# EAGLE board A500R8 (EAGLE 7.6.0), part 1 of 5
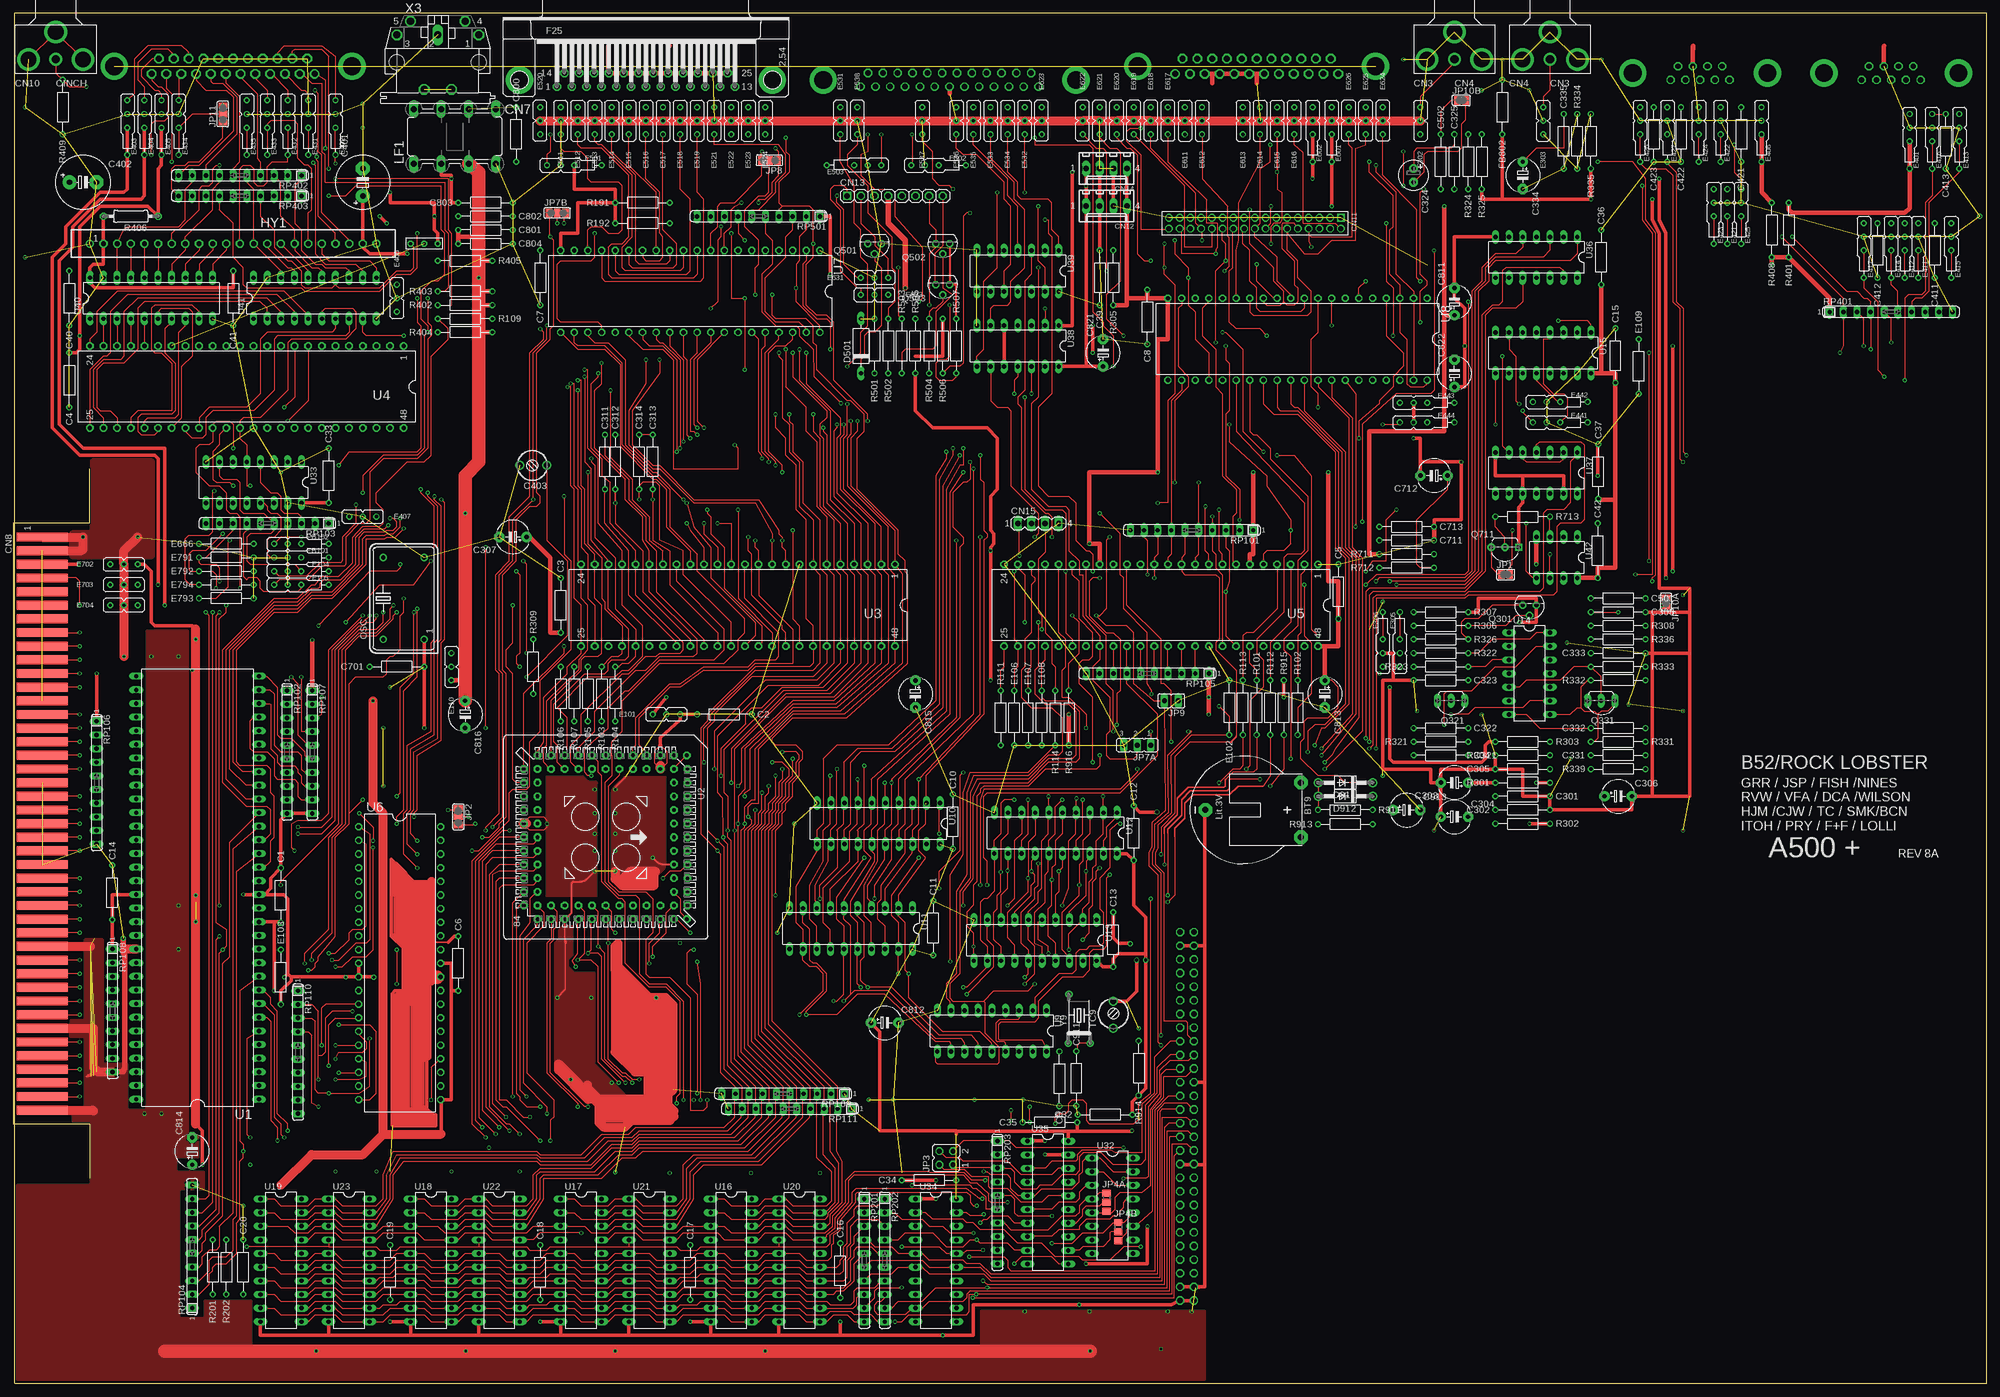
[diagram p9: board, top side]
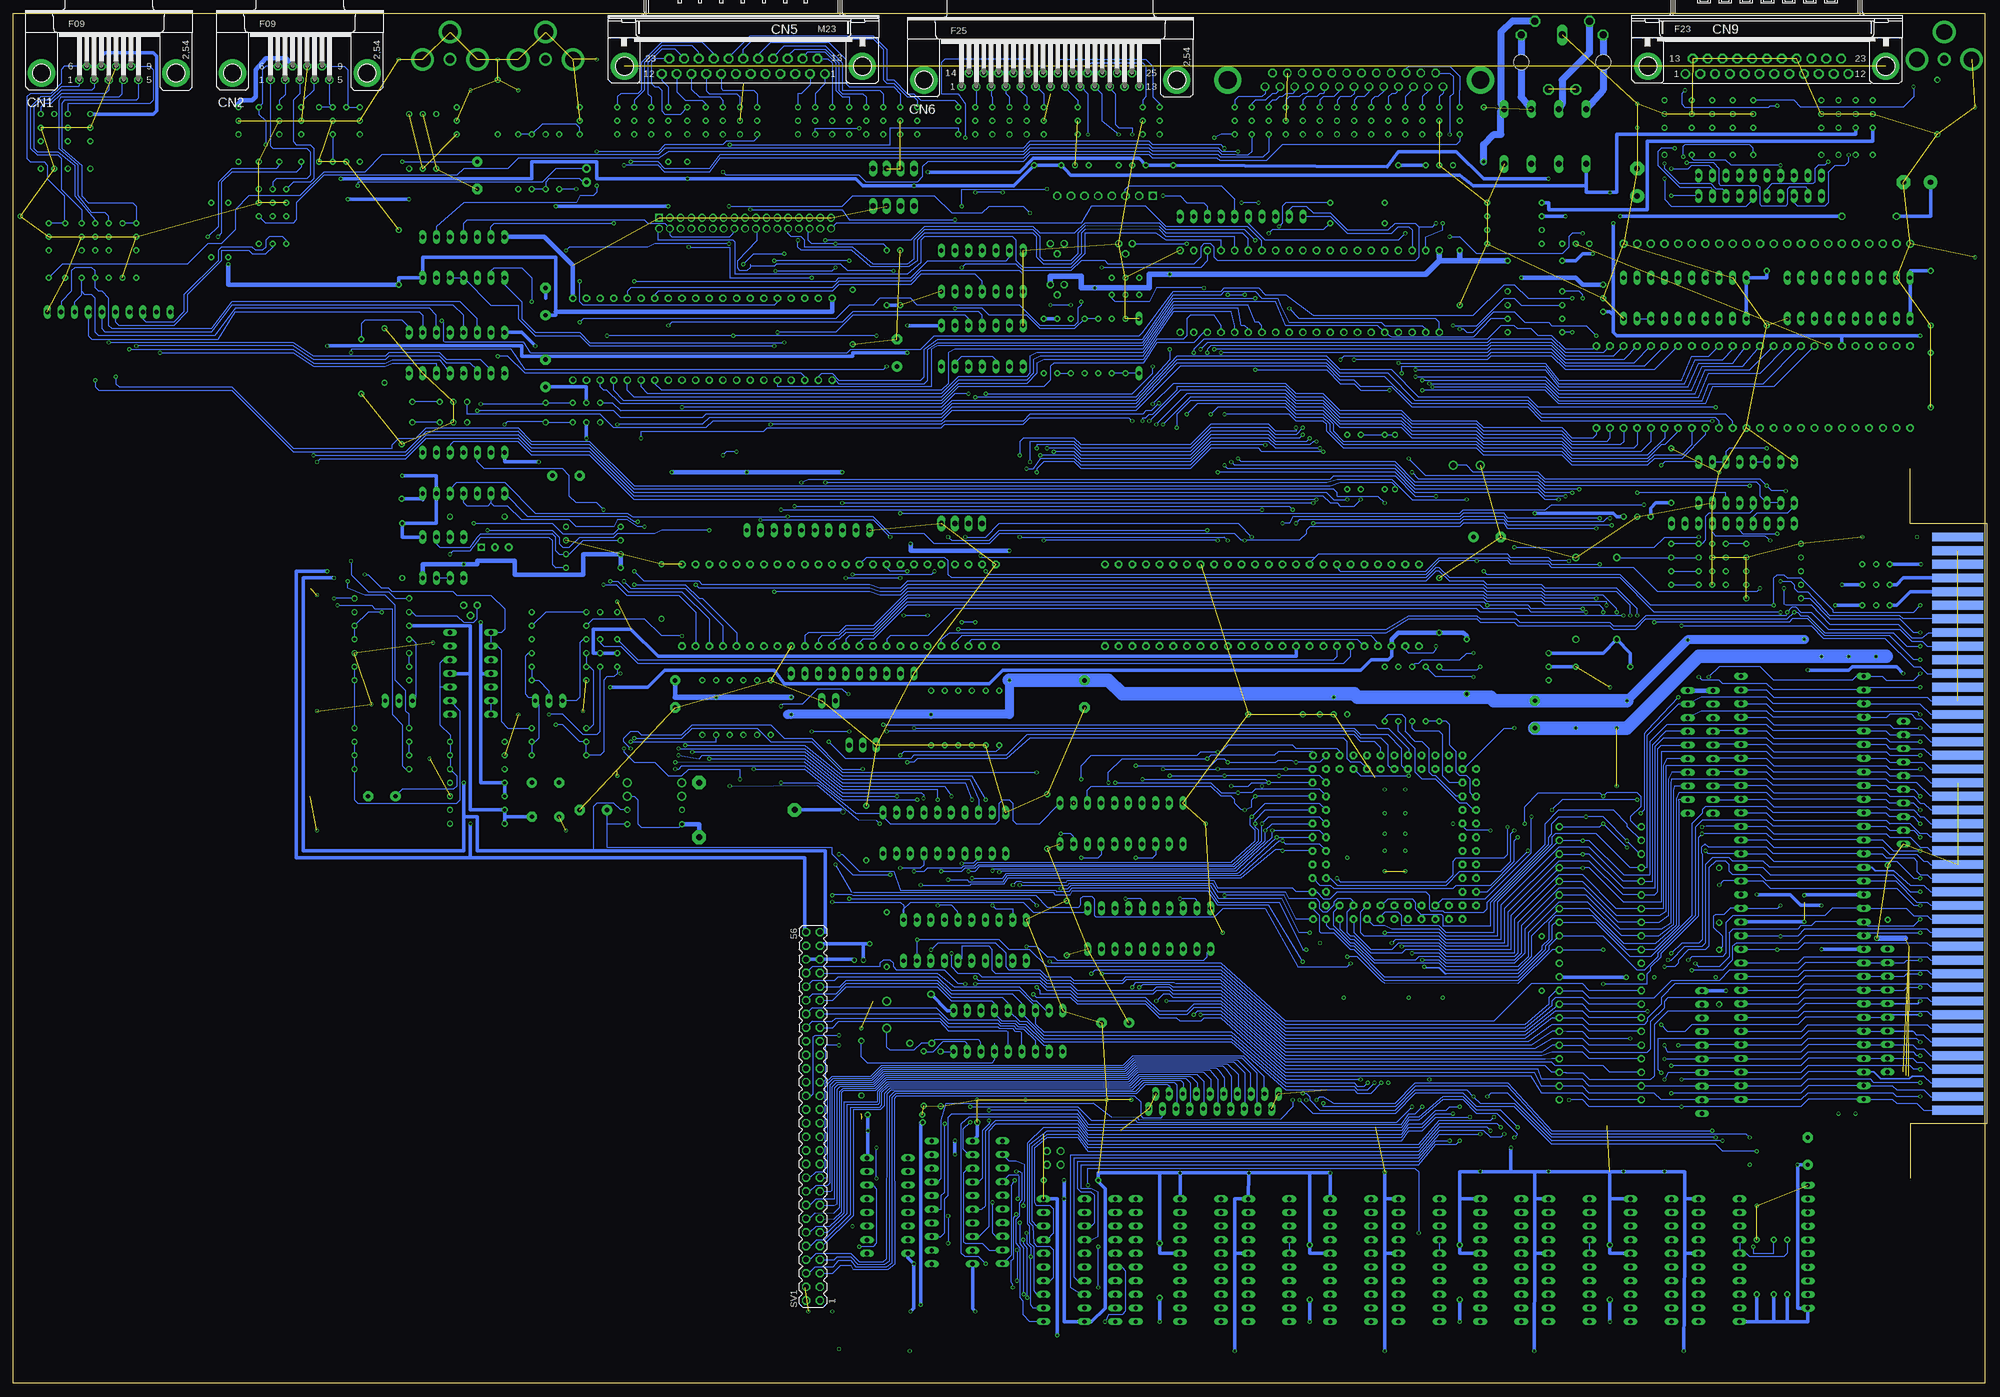
[diagram p10: board, bottom side, seen from below]

Size 367.26 x 254.94 mm. Coordinates in mm from the lower left corner, seen from the top.
Outline: 0.25,0 367.26,0 367.26,254.94 0.25,254.94
Outline: 0.23,0 0.23,254.94
Copper layers (1*16): Top 0.035mm / dielectric 1.5mm / Bottom 0.035mm
Design rules "dirt_cheap_dirty_boards.v1": minimum track width 5mil, minimum drill 12mil, track to track 5mil, track to pad 5mil, pad to pad 5mil, via to via 5mil, smd to smd 0mil, copper to edge 10mil, drill to drill 10mil, minimum pad ring 10mil, minimum via ring 6mil, stop-mask expansion 2mil, vias tented up to drill 25mil, thermal gap 10mil

## Footprints (pad centres in the part's own frame; a part is rotated, then mirrored left to right if it is on the bottom)
CR2032H = drill 1.118 pad 2.54 octagon: + 5.08,10.795; +@1 -5.08,10.795; - 0,-6.985
C10B4 = drill 0.6: 1 -5.08,0; 2 5.08,0
E5-6 = drill 0.813 pad 1.905: + -2.54,0 | drill 0.813 pad 1.905 octagon: - 2.54,0
R10B4 = drill 0.6: 1 -5.08,0; 2 5.08,0
E2,5-6 = drill 0.813 pad 1.6: + -1.27,0 | drill 0.813 pad 1.6 octagon: - 1.27,0
E5-10,5 = drill 1.016 pad 2.54: + -2.54,0 | drill 1.016 pad 2.54 octagon: - 2.54,0
CTRIM3050.504 = drill 1.1: 1 -2.5,0; 2 2.5,0
F09HP = drill 1.016 octagon: 1 -5.486,-1.27; 2 -2.743,-1.27; 3 0,-1.27; 4 2.743,-1.27; 5 5.486,-1.27; 6 -4.115,1.27; 7 -1.372,1.27; 8 1.372,1.27; 9 4.115,1.27 | drill 3.302 pad 5.08: G1 -12.522,0; G2 12.522,0
CINCH-B = drill 2.9 pad 4.2: P$2 -5.08,0; P$3 5.08,0; P$4 0,5.08 | drill 1.5 pad 2.4: S 0,0
M23H_FC = drill 1.1 pad 1.8: 1 -15.172,1.429 | drill 1.1 pad 1.8 octagon: 2 -12.403,1.429; 3 -9.66,1.429; 4 -6.891,1.429; 5 -4.123,1.429; 6 -1.379,1.429; 7 1.389,1.429; 8 4.158,1.429; 9 6.901,1.429; 10 9.669,1.429; 11 12.438,1.429; 12 15.181,1.429; 13 -13.8,-1.429; 14 -11.031,-1.429; 15 -8.263,-1.429; 16 -5.52,-1.429; 17 -2.751,-1.429; 18 0.018,-1.429; 19 2.761,-1.429; 20 5.529,-1.429; 21 8.298,-1.429; 22 11.041,-1.429; 23 13.81,-1.429 | drill 3.302 pad 5.08: G1 -22.131,0; G2 22.131,0
F25HP = drill 1.016 octagon: 1 -16.561,-1.27; 2 -13.792,-1.27; 3 -11.049,-1.27; 4 -8.28,-1.27; 5 -5.512,-1.27; 6 -2.769,-1.27; 7 0,-1.27; 8 2.769,-1.27; 9 5.512,-1.27; 10 8.28,-1.27; 11 11.049,-1.27; 12 13.792,-1.27; 13 16.561,-1.27; 14 -15.189,1.27; 15 -12.421,1.27; 16 -9.652,1.27; 17 -6.909,1.27; 18 -4.14,1.27; 19 -1.372,1.27; 20 1.372,1.27; 21 4.14,1.27; 22 6.909,1.27; 23 9.652,1.27; 24 12.421,1.27; 25 15.189,1.27 | drill 3.302 pad 5.08: G1 -23.52,0; G2 23.52,0
LKONT_43 = smd 1.65 x 9.5: 1 -53.34,0; 3 -50.8,0; 5 -48.26,0; 7 -45.72,0; 9 -43.18,0; 11 -40.64,0; 13 -38.1,0; 15 -35.56,0; 17 -33.02,0; 19 -30.48,0; 21 -27.94,0; 23 -25.4,0; 25 -22.86,0; 27 -20.32,0; 29 -17.78,0; 31 -15.24,0; 33 -12.7,0; 35 -10.16,0; 37 -7.62,0; 39 -5.08,0; 41 -2.54,0; 43 0,0; 45 2.54,0; 47 5.08,0; 49 7.62,0; 51 10.16,0; 53 12.7,0; 55 15.24,0; 57 17.78,0; 59 20.32,0; 61 22.86,0; 63 25.4,0; 65 27.94,0; 67 30.48,0; 69 33.02,0; 71 35.56,0; 73 38.1,0; 75 40.64,0; 77 43.18,0; 79 45.72,0; 81 48.26,0; 83 50.8,0; 85 53.34,0 | smd 1.65 x 9.5 bottom: 2 -53.34,0; 4 -50.8,0; 6 -48.26,0; 8 -45.72,0; 10 -43.18,0; 12 -40.64,0; 14 -38.1,0; 16 -35.56,0; 18 -33.02,0; 20 -30.48,0; 22 -27.94,0; 24 -25.4,0; 26 -22.86,0; 28 -20.32,0; 30 -17.78,0; 32 -15.24,0; 34 -12.7,0; 36 -10.16,0; 38 -7.62,0; 40 -5.08,0; 42 -2.54,0; 44 0,0; 46 2.54,0; 48 5.08,0; 50 7.62,0; 52 10.16,0; 54 12.7,0; 56 15.24,0; 58 17.78,0; 60 20.32,0; 62 22.86,0; 64 25.4,0; 66 27.94,0; 68 30.48,0; 70 33.02,0; 72 35.56,0; 74 38.1,0; 76 40.64,0; 78 43.18,0; 80 45.72,0; 82 48.26,0; 84 50.8,0; 86 53.34,0
F23H_FC = drill 1.1 pad 1.8: 1 -15.172,-1.429 | drill 1.1 pad 1.8 octagon: 2 -12.403,-1.429; 3 -9.66,-1.429; 4 -6.891,-1.429; 5 -4.123,-1.429; 6 -1.38,-1.429; 7 1.389,-1.429; 8 4.158,-1.429; 9 6.901,-1.429; 10 9.669,-1.429; 11 12.438,-1.429; 12 15.181,-1.429; 13 -13.8,1.429; 14 -11.032,1.429; 15 -8.263,1.429; 16 -5.52,1.429; 17 -2.751,1.429; 18 0.017,1.429; 19 2.761,1.429; 20 5.529,1.429; 21 8.298,1.429; 22 11.041,1.429; 23 13.81,1.429 | drill 3.302 pad 5.08: G1 -22.131,0; G2 22.131,0
2X17M = drill 0.914 square: 1 -14.73,-1 | drill 0.914: 2 -14.73,1; 3 -12.73,-1; 4 -12.73,1; 5 -10.73,-1; 6 -10.73,1; 7 -8.73,-1; 8 -8.73,1; 9 -6.73,-1; 10 -6.73,1; 11 -4.73,-1; 12 -4.73,1; 13 -2.73,-1; 14 -2.73,1; 15 -0.73,-1; 16 -0.73,1; 17 1.27,-1; 18 1.27,1; 19 3.27,-1; 20 3.27,1; 21 5.27,-1; 22 5.27,1; 23 7.27,-1; 24 7.27,1; 25 9.27,-1; 26 9.27,1; 27 11.27,-1; 28 11.27,1; 29 13.27,-1; 30 13.27,1; 31 15.27,-1; 32 15.27,1; 33 17.27,-1; 34 17.27,1
6410-04 = drill 1.016 long: 1 3.81,0; 2 1.27,0; 3 -1.27,0; 4 -3.81,0
1X08S = drill 1.016 square: 1 -7.62,0 | drill 1.016 octagon: 2 -5.08,0; 3 -2.54,0; 4 0,0; 5 2.54,0; 6 5.08,0; 7 7.62,0; 8 10.16,0
MA04-1 = drill 1.016 long: 1 -3.81,0; 2 -1.27,0; 3 1.27,0; 4 3.81,0
D-10 = drill 0.813 long: A 5.08,0; C -5.08,0
DO41-10 = drill 1.118: A 5.08,0; C -5.08,0
EMIFILTER = drill 0.6: 1 1.27,0; 2 6.35,0; 3 3.81,0
EMIFILTLONG = drill 0.6: 1 -3.81,0; 2 1.27,0; 3 6.35,0; 4 3.81,0
SIP22 = drill 0.9 pad 1.5: 1 -26.67,0 | drill 0.9 pad 1.5 octagon: 2 -24.13,0; 3 -21.59,0; 4 -19.05,0; 5 -16.51,0; 6 -13.97,0; 7 -11.43,0; 8 -8.89,0; 9 -6.35,0; 10 -3.81,0; 11 -1.27,0; 12 1.27,0; 13 3.81,0; 14 6.35,0; 15 8.89,0; 16 11.43,0; 17 13.97,0; 18 16.51,0; 19 19.05,0; 20 21.59,0; 21 24.13,0; 22 26.67,0
SJ = smd 1.168 x 1.6: 1 -0.762,0; 2 0.762,0
SJ_2 = smd 1.168 x 1.6: 1 -1.524,0; 2 0,0; 3 1.524,0
JP2Q = drill 0.914 octagon: 1 -1.27,-1.27; 2 -1.27,1.27; 3 1.27,-1.27; 4 1.27,1.27
A0R-JMP = smd 1.5 x 1.3: 1 0,1.7; 2 0,0; 3 0,-1.7
JP2 = drill 0.914 long: 1 -2.54,0; 2 0,0; 3 2.54,0
JP1 = drill 0.914 long: 1 0,-1.27; 2 0,1.27
DK31 = drill 1.118 long: 1 7.62,5.08; 2 2.54,5.08; 3 -2.54,5.08; 4 -7.62,5.08; 5 -7.62,-5.08; 6 -2.54,-5.08; 7 2.54,-5.08; 8 7.62,-5.08
AMIGACRYSTAL = drill 0.813: 1 -7.62,-3.81; 2 7.62,-3.81; 3 7.62,3.81; 4 -7.62,3.81
TO92D = drill 0.813 octagon: B 0,1.905; C 1.27,0; E -1.27,0
TO92- = drill 0.813 long: 1 2.54,0; 2 0,0; 3 -2.54,0
TO92 = drill 0.813 octagon: 1 1.27,0; 2 0,1.905; 3 -1.27,0
TRANSISTOR_TO92-ECB = drill 0.813 square: 1 -2.54,0 | drill 0.7 pad 1.422: 2 0,0; 3 2.54,0
0207/10 = drill 0.813 octagon: 1 -5.08,0; 2 5.08,0
SIL10 = drill 0.813 long: 1 -11.43,0; 2 -8.89,0; 3 -6.35,0; 4 -3.81,0; 5 -1.27,0; 6 1.27,0; 7 3.81,0; 8 6.35,0; 9 8.89,0; 10 11.43,0
AMIGA56 = drill 1.016 octagon: 1 -24.13,-1.27; 2 -24.13,1.27; 3 -21.59,-1.27; 4 -21.59,1.27; 5 -19.05,-1.27; 6 -19.05,1.27; 7 -16.51,-1.27; 8 -16.51,1.27; 9 -13.97,-1.27; 10 -13.97,1.27; 11 -11.43,-1.27; 12 -11.43,1.27; 13 -8.89,-1.27; 14 -8.89,1.27; 15 -6.35,-1.27; 16 -6.35,1.27; 17 -3.81,-1.27; 18 -3.81,1.27; 19 -1.27,-1.27; 20 -1.27,1.27; 21 1.27,-1.27; 22 1.27,1.27; 23 3.81,-1.27; 24 3.81,1.27; 25 6.35,-1.27; 26 6.35,1.27; 27 8.89,-1.27; 28 8.89,1.27; 29 11.43,-1.27; 30 11.43,1.27; 31 13.97,-1.27; 32 13.97,1.27; 33 16.51,-1.27; 34 16.51,1.27; 35 19.05,-1.27; 36 19.05,1.27; 37 21.59,-1.27; 38 21.59,1.27; 39 24.13,-1.27; 40 24.13,1.27; 41 26.67,-1.27; 42 26.67,1.27; 43 29.21,-1.27; 44 29.21,1.27; 45 31.75,-1.27; 46 31.75,1.27; 47 34.29,-1.27; 48 34.29,1.27; 49 36.83,-1.27; 50 36.83,1.27; 51 39.37,-1.27; 52 39.37,1.27; 53 41.91,-1.27; 54 41.91,1.27; 55 44.45,-1.27; 56 44.45,1.27
DIL64 = drill 0.813 long: 1 -39.37,-11.43; 2 -36.83,-11.43; 3 -34.29,-11.43; 4 -31.75,-11.43; 5 -29.21,-11.43; 6 -26.67,-11.43; 7 -24.13,-11.43; 8 -21.59,-11.43; 9 -19.05,-11.43; 10 -16.51,-11.43; 11 -13.97,-11.43; 12 -11.43,-11.43; 13 -8.89,-11.43; 14 -6.35,-11.43; 15 -3.81,-11.43; 16 -1.27,-11.43; 17 1.27,-11.43; 18 3.81,-11.43; 19 6.35,-11.43; 20 8.89,-11.43; 21 11.43,-11.43; 22 13.97,-11.43; 23 16.51,-11.43; 24 19.05,-11.43; 25 21.59,-11.43; 26 24.13,-11.43; 27 26.67,-11.43; 28 29.21,-11.43; 29 31.75,-11.43; 30 34.29,-11.43; 31 36.83,-11.43; 32 39.37,-11.43; 33 39.37,11.43; 34 36.83,11.43; 35 34.29,11.43; 36 31.75,11.43; 37 29.21,11.43; 38 26.67,11.43; 39 24.13,11.43; 40 21.59,11.43; 41 19.05,11.43; 42 16.51,11.43; 43 13.97,11.43; 44 11.43,11.43; 45 8.89,11.43; 46 6.35,11.43; 47 3.81,11.43; 48 1.27,11.43; 49 -1.27,11.43; 50 -3.81,11.43; 51 -6.35,11.43; 52 -8.89,11.43; 53 -11.43,11.43; 54 -13.97,11.43; 55 -16.51,11.43; 56 -19.05,11.43; 57 -21.59,11.43; 58 -24.13,11.43; 59 -26.67,11.43; 60 -29.21,11.43; 61 -31.75,11.43; 62 -34.29,11.43; 63 -36.83,11.43; 64 -39.37,11.43
PLCC84 = drill 0.7 pad 1.4: 1 0,15.24 | drill 0.7 pad 1.4 octagon: 2 0,12.7; 3 -2.54,15.24; 4 -2.54,12.7; 5 -5.08,15.24; 6 -5.08,12.7; 7 -7.62,15.24; 8 -7.62,12.7; 9 -10.16,15.24; 10 -10.16,12.7; 11 -12.7,15.24; 12 -15.24,12.7; 13 -12.7,12.7; 14 -15.24,10.16; 15 -12.7,10.16; 16 -15.24,7.62; 17 -12.7,7.62; 18 -15.24,5.08; 19 -12.7,5.08; 20 -15.24,2.54; 21 -12.7,2.54; 22 -15.24,0; 23 -12.7,0; 24 -15.24,-2.54; 25 -12.7,-2.54; 26 -15.24,-5.08; 27 -12.7,-5.08; 28 -15.24,-7.62; 29 -12.7,-7.62; 30 -15.24,-10.16; 31 -12.7,-10.16; 32 -15.24,-12.7; 33 -12.7,-15.24; 34 -12.7,-12.7; 35 -10.16,-15.24; 36 -10.16,-12.7; 37 -7.62,-15.24; 38 -7.62,-12.7; 39 -5.08,-15.24; 40 -5.08,-12.7; 41 -2.54,-15.24; 42 -2.54,-12.7; 43 0,-15.24; 44 0,-12.7; 45 2.54,-15.24; 46 2.54,-12.7; 47 5.08,-15.24; 48 5.08,-12.7; 49 7.62,-15.24; 50 7.62,-12.7; 51 10.16,-15.24; 52 10.16,-12.7; 53 12.7,-15.24; 54 15.24,-12.7; 55 12.7,-12.7; 56 15.24,-10.16; 57 12.7,-10.16; 58 15.24,-7.62; 59 12.7,-7.62; 60 15.24,-5.08; 61 12.7,-5.08; 62 15.24,-2.54; 63 12.7,-2.54; 64 15.24,0; 65 12.7,0; 66 15.24,2.54; 67 12.7,2.54; 68 15.24,5.08; 69 12.7,5.08; 70 15.24,7.62; 71 12.7,7.62; 72 15.24,10.16; 73 12.7,10.16; 74 15.24,12.7; 75 12.7,15.24; 76 12.7,12.7; 77 10.16,15.24; 78 10.16,12.7; 79 7.62,15.24; 80 7.62,12.7; 81 5.08,15.24; 82 5.08,12.7; 83 2.54,15.24; 84 2.54,12.7
DIP48-6 = drill 0.8 pad 1.4: 1 -27.94,-7.62 | drill 0.8 pad 1.4 octagon: 2 -25.4,-7.62; 3 -22.86,-7.62; 4 -20.32,-7.62; 5 -17.78,-7.62; 6 -15.24,-7.62; 7 -12.7,-7.62; 8 -10.16,-7.62; 9 -7.62,-7.62; 10 -5.08,-7.62; 11 -2.54,-7.62; 12 0,-7.62; 13 2.54,-7.62; 14 5.08,-7.62; 15 7.62,-7.62; 16 10.16,-7.62; 17 12.7,-7.62; 18 15.24,-7.62; 19 17.78,-7.62; 20 20.32,-7.62; 21 22.86,-7.62; 22 25.4,-7.62; 23 27.94,-7.62; 24 30.48,-7.62; 25 30.48,7.62; 26 27.94,7.62; 27 25.4,7.62; 28 22.86,7.62; 29 20.32,7.62; 30 17.78,7.62; 31 15.24,7.62; 32 12.7,7.62; 33 10.16,7.62; 34 7.62,7.62; 35 5.08,7.62; 36 2.54,7.62; 37 0,7.62; 38 -2.54,7.62; 39 -5.08,7.62; 40 -7.62,7.62; 41 -10.16,7.62; 42 -12.7,7.62; 43 -15.24,7.62; 44 -17.78,7.62; 45 -20.32,7.62; 46 -22.86,7.62; 47 -25.4,7.62; 48 -27.94,7.62
DIP42-6 = drill 0.813 octagon: 1 -24.13,-7.62; 2 -21.59,-7.62; 3 -19.05,-7.62; 4 -16.51,-7.62; 5 -13.97,-7.62; 6 -11.43,-7.62; 7 -8.89,-7.62; 8 -6.35,-7.62; 9 -3.81,-7.62; 10 -1.27,-7.62; 11 1.27,-7.62; 12 3.81,-7.62; 13 6.35,-7.62; 14 8.89,-7.62; 15 11.43,-7.62; 16 13.97,-7.62; 17 16.51,-7.62; 18 19.05,-7.62; 19 21.59,-7.62; 20 24.13,-7.62; 21 26.67,-7.62; 22 26.67,7.62; 23 24.13,7.62; 24 21.59,7.62; 25 19.05,7.62; 26 16.51,7.62; 27 13.97,7.62; 28 11.43,7.62; 29 8.89,7.62; 30 6.35,7.62; 31 3.81,7.62; 32 1.27,7.62; 33 -1.27,7.62; 34 -3.81,7.62; 35 -6.35,7.62; 36 -8.89,7.62; 37 -11.43,7.62; 38 -13.97,7.62; 39 -16.51,7.62; 40 -19.05,7.62; 41 -21.59,7.62; 42 -24.13,7.62
DIP40-6 = drill 0.813 octagon: 1 -24.13,-7.62; 2 -21.59,-7.62; 3 -19.05,-7.62; 4 -16.51,-7.62; 5 -13.97,-7.62; 6 -11.43,-7.62; 7 -8.89,-7.62; 8 -6.35,-7.62; 9 -3.81,-7.62; 10 -1.27,-7.62; 11 1.27,-7.62; 12 3.81,-7.62; 13 6.35,-7.62; 14 8.89,-7.62; 15 11.43,-7.62; 16 13.97,-7.62; 17 16.51,-7.62; 18 19.05,-7.62; 19 21.59,-7.62; 20 24.13,-7.62; 21 24.13,7.62; 22 21.59,7.62; 23 19.05,7.62; 24 16.51,7.62; 25 13.97,7.62; 26 11.43,7.62; 27 8.89,7.62; 28 6.35,7.62; 29 3.81,7.62; 30 1.27,7.62; 31 -1.27,7.62; 32 -3.81,7.62; 33 -6.35,7.62; 34 -8.89,7.62; 35 -11.43,7.62; 36 -13.97,7.62; 37 -16.51,7.62; 38 -19.05,7.62; 39 -21.59,7.62; 40 -24.13,7.62
DIL18 = drill 0.813 long: 1 -10.16,-3.81; 2 -7.62,-3.81; 3 -5.08,-3.81; 4 -2.54,-3.81; 5 0,-3.81; 6 2.54,-3.81; 7 5.08,-3.81; 8 7.62,-3.81; 9 10.16,-3.81; 10 10.16,3.81; 11 7.62,3.81; 12 5.08,3.81; 13 2.54,3.81; 14 0,3.81; 15 -2.54,3.81; 16 -5.08,3.81; 17 -7.62,3.81; 18 -10.16,3.81
DIL20 = drill 0.813 long: 1 -11.43,-3.81; 2 -8.89,-3.81; 3 -6.35,-3.81; 4 -3.81,-3.81; 5 -1.27,-3.81; 6 1.27,-3.81; 7 3.81,-3.81; 8 6.35,-3.81; 9 8.89,-3.81; 10 11.43,-3.81; 11 11.43,3.81; 12 8.89,3.81; 13 6.35,3.81; 14 3.81,3.81; 15 1.27,3.81; 16 -1.27,3.81; 17 -3.81,3.81; 18 -6.35,3.81; 19 -8.89,3.81; 20 -11.43,3.81
DIL14 = drill 0.813 long: 1 -7.62,-3.81; 2 -5.08,-3.81; 3 -2.54,-3.81; 4 0,-3.81; 5 2.54,-3.81; 6 5.08,-3.81; 7 7.62,-3.81; 8 7.62,3.81; 9 5.08,3.81; 10 2.54,3.81; 11 0,3.81; 12 -2.54,3.81; 13 -5.08,3.81; 14 -7.62,3.81
DIL16 = drill 0.813 long: 1 -8.89,-3.81; 2 -6.35,-3.81; 3 -3.81,-3.81; 4 -1.27,-3.81; 5 1.27,-3.81; 6 3.81,-3.81; 7 6.35,-3.81; 8 8.89,-3.81; 9 8.89,3.81; 10 6.35,3.81; 11 3.81,3.81; 12 1.27,3.81; 13 -1.27,3.81; 14 -3.81,3.81; 15 -6.35,3.81; 16 -8.89,3.81
DIL-08 = drill 0.813 long: 1 -3.81,-3.81; 2 -1.27,-3.81; 3 1.27,-3.81; 4 3.81,-3.81; 5 3.81,3.81; 6 1.27,3.81; 7 -1.27,3.81; 8 -3.81,3.81
HY1A = drill 0.6 octagon: 1 1.27,0; 2 3.81,0; 3 6.35,0
MAB5SH = drill 1.321 octagon: 1 7.62,5.08; 3 -7.62,5.08; 4 5.08,7.62; 5 -5.08,7.62; PE -2.54,-5.08; PE@ 2.54,-5.08 | drill 1.321 long: 2 0,5.08 | hole 2.794: 7.62,0; -7.62,0
HC49TL-H = drill 0.813: 1 1.397,-7.62; 2 -2.667,-7.62; 3 -2.54,1.524

## Placement (x,y rotation side)
BT9  CR2032  [CR2032H]  228.85,106.68 270 top
C1  0.33uF  [C10B4]  49.78,90.81 90 top
C2  0.33uF  [C10B4]  132.33,124.46 0 top
C3  0.33uF  [C10B4]  101.85,144.78 90 top
C4  0.33uF  [C10B4]  10.41,186.69 270 top
C5  0.33uF  [C10B4]  246.63,147.32 90 top
C6  0.33uF  [C10B4]  82.8,78.11 90 top
C7  0.1uF  [C10B4]  98.04,205.74 270 top
C8  0.1uF  [C10B4]  211.07,198.44 270 top
C9  .33uF  [C10B4]  194.69,56.64 270 top
C10  0.1uF  [C10B4]  174.88,104.52 90 top
C11  0.33uF  [C10B4]  171.2,84.71 90 top
C12  0.1uF  [C10B4]  208.53,102.36 90 top
C13  0.33uF  [C10B4]  204.72,82.55 90 top
C14  0.33uF  [C10B4]  18.41,91.31 90 top
C15  0.1uF  [C10B4]  298.2,191.26 90 top
C16  0.33uF  [C10B4]  153.92,20.95 90 top
C17  0.33uF  [C10B4]  125.98,20.62 90 top
C18  0.33uF  [C10B4]  98.04,20.62 90 top
C19  0.33uF  [C10B4]  70.1,20.62 90 top
C20  0.33uF  [C10B4]  42.8,21.59 90 top
C32  0.1uF  [C10B4]  203.2,49.97 180 top
C33  .01uF  [C10B4]  58.67,168.91 90 top
C34  0.1uF  [C10B4]  170.43,37.78 180 top
C35  0.1uF  [C10B4]  192.91,48.51 180 top
C36  0.1uF  [C10B4]  295.53,209.55 90 top
C37  0.1uF  [C10B4]  295.02,169.67 90 top
C39  .01uF  [C10B4]  202.18,205.74 270 top
C40  0.33uF  [C10B4]  10.41,201.93 270 top
C41  0.33uF  [C10B4]  40.89,201.93 270 top
C42  .33uF  [C10B4]  294.89,154.94 90 top
C301  0.33uF  [C10B4]  280.92,109.22 0 top
C302  0.33uF  [C10B4]  280.92,106.68 180 top
C303  22uF  [E5-6]  268.22,111.76 180 top
C304  22uF  [E5-6]  268.22,105.41 0 top
C305  0.33uF  [C10B4]  280.92,114.3 180 top
C306  10uF  [E5-6]  298.7,109.22 0 top
C307  1000uF  [E5-6]  92.96,157.48 180 top
C308  .01uF  [C10B4]  298.7,143.51 0 top
C311  .047uF  [C10B4]  110.11,171.45 90 top
C312  .047uF  [C10B4]  112.01,171.45 90 top
C313  .047uF  [C10B4]  119,171.45 90 top
C314  .047uF  [C10B4]  116.46,171.45 90 top
C321  .01uF  [C10B4]  265.68,116.84 0 top
C322  6800pF  [R10B4]  265.68,121.92 0 top
C323  3900pF  [C10B4]  265.68,130.81 0 top
C324  22uF  [E2,5-6]  260.6,224.79 270 top
C325  .33uF  [C10B4]  268.22,227.33 90 top
C331  .01uF  [C10B4]  298.7,116.84 180 top
C332  6800pF  [C10B4]  298.7,121.92 180 top
C333  3900pF  [C10B4]  298.7,135.89 180 top
C334  22uF  [E5-6]  280.92,224.79 270 top
C335  .33uF  [C10B4]  288.54,231.14 90 top
C401  1000uF  [E5-10,5]  65.02,223.52 90 top
C402  1000uF  [E5-10,5]  12.95,223.52 0 top
C403  47pF  [CTRIM3050.504]  96.77,170.81 180 top
C411  1000pF  [C10B4]  357.63,210.82 270 top
C412  1000pF  [C10B4]  346.96,210.82 270 top
C413  1000pF  [C10B4]  359.66,231.14 270 top
C421  1000pF  [C10B4]  321.56,232.41 270 top
C422  1000pF  [C10B4]  310.39,232.41 270 top
C423  1000pF  [C10B4]  305.31,232.41 270 top
C501  .33uF  [C10B4]  298.7,146.05 0 top
C502  .33uF  [C10B4]  265.68,227.33 90 top
C701  .01uF  [C10B4]  71.37,133.35 180 top
C711  .1uF  [C10B4]  259.33,156.84 0 top
C712  10uF  [E5-6]  264.41,168.91 180 top
C713  .01uF  [C10B4]  259.33,159.38 0 top
C800  0.1uF  [C10B4]  93.6,232.41 90 top
C801  0.1uF  [C10B4]  87.88,214.63 0 top
C802  0.1uF  [C10B4]  87.88,217.17 0 top
C803  0.1uF  [C10B4]  87.88,219.71 180 top
C804  33uF  [C10B4]  87.88,212.09 0 top
C811  100uF  [E5-6]  268.22,201.29 90 top
C812  100uF  [E5-6]  162.18,67.06 0 top
C813  100uF  [E5-6]  244.09,128.27 270 top
C814  100uF  [E5-6]  33.27,43.18 90 top
C815  100uF  [E5-6]  167.89,128.27 270 top
C816  100uF  [E5-6]  84.07,124.46 270 top
C821  47uF  [E5-6]  202.82,191.77 90 top
C822  47uF  [E5-6]  268.22,187.96 90 top
C911  22pF  [C10B4]  197.87,56.71 90 top
C913  4.7uF  [E5-6]  259.33,106.68 0 top
CN1  [F09HP]  349.5,243.84 0 bottom
CN2  [F09HP]  313.94,243.84 0 bottom
CN3  CN4  [CINCH-B]  268.22,246.38 0 top
CN4  CN3  [CINCH-B]  286,246.38 0 top
CN5  FLOPPY_EXT_23D_SUB_M  [M23H_FC]  231.39,245.11 180 bottom
CN6  SERIAL PORT  [F25HP]  174.24,242.57 0 bottom
CN7  PARALLEL PORT  [F25HP]  117.73,242.57 0 top
CN8  A500-EXPANSION_EDGE  [LKONT_43]  5.33,104.14 270 top
CN9  VIDEO_PORT_23D_SUB_F  [F23H_FC]  40.89,245.11 0 bottom
CN10  CINCH  [CINCH-B]  7.87,246.38 0 top
CN11  FLOPPY_INT  [2X17M]  232.35,215.9 180 top
CN12  [6410-04]  203.45,219.07 180 top
CN13  [1X08S]  162.81,220.98 0 top
CN14  [6410-04]  203.45,226.06 180 top
CN15  [MA04-1]  190.75,160.02 0 top
D501  1N914  [D-10]  157.73,193.04 90 top
D911  1N914  [DO41-10]  247.9,111.76 180 top
D912  1N914  [DO41-10]  247.9,109.22 180 top
E101  .01uF  [EMIFILTER]  117.73,124.46 0 top
E102  47pF  [R10B4]  226.31,125.73 270 top
E103  47pF  [C10B4]  49.78,75.56 90 top
E104  EMIFILTERLONG  [EMIFILTLONG]  54.86,151.13 180 top
E105  EMIFILTERLONG  [EMIFILTLONG]  54.86,148.59 180 top
E106  47pF  [R10B4]  186.31,123.83 90 top
E107  47pF  [R10B4]  188.85,123.83 90 top
E108  47pF  [R10B4]  191.39,123.83 90 top
E109  47pF  [R10B4]  302.51,189.23 90 top
E110  EMIFILTER  [EMIFILTER]  81.53,129.54 90 top
E302  EMIFILTER  [EMIFILTER]  261.87,231.14 90 top
E303  EMIFILTER  [EMIFILTER]  284.73,231.14 90 top
E305  EMIFILTERLONG  [EMIFILTLONG]  258.06,139.7 270 top
E306  EMIFILTERLONG  [EMIFILTLONG]  254.89,139.7 270 top
E401  EMIFILTERLONG  [EMIFILTLONG]  352.93,229.87 90 top
E402  150pF  [EMIFILTLONG]  59.94,232.41 90 top
E403  EMIFILTERLONG  [EMIFILTLONG]  21.21,232.41 90 top
E404  EMIFILTERLONG  [EMIFILTLONG]  24.38,232.41 90 top
E405  EMIFILTERLONG  [EMIFILTLONG]  27.56,232.41 90 top
E406  EMIFILTER  [EMIFILTER]  71.37,205.74 270 top
E407  .01uF  [EMIFILTER]  68.83,161.29 180 top
E408  EMIFILTERLONG  [EMIFILTLONG]  325.37,231.14 90 top
E411  EMIFILTERLONG  [EMIFILTLONG]  354.58,209.55 90 top
E412  EMIFILTERLONG  [EMIFILTLONG]  352.04,209.55 90 top
E413  EMIFILTERLONG  [EMIFILTLONG]  362.2,229.87 90 top
E414  EMIFILTERLONG  [EMIFILTLONG]  349.5,209.55 90 top
E415  EMIFILTERLONG  [EMIFILTLONG]  360.68,209.55 90 top
E416  EMIFILTERLONG  [EMIFILTLONG]  357.12,229.87 90 top
E417  EMIFILTERLONG  [EMIFILTLONG]  344.42,209.55 90 top
E421  EMIFILTERLONG  [EMIFILTLONG]  319.02,215.9 90 top
E422  EMIFILTERLONG  [EMIFILTLONG]  317.75,231.14 90 top
E423  EMIFILTERLONG  [EMIFILTLONG]  316.48,215.9 90 top
E424  EMIFILTERLONG  [EMIFILTLONG]  313.69,231.14 90 top
E425  EMIFILTERLONG  [EMIFILTLONG]  321.56,215.9 90 top
E426  EMIFILTERLONG  [EMIFILTLONG]  302.77,231.14 90 top
E427  EMIFILTERLONG  [EMIFILTLONG]  307.85,231.14 90 top
E431  EMIFILTERLONG  [EMIFILTLONG]  54.86,232.41 90 top
E432  EMIFILTERLONG  [EMIFILTLONG]  51.05,232.41 90 top
E433  EMIFILTERLONG  [EMIFILTLONG]  47.24,232.41 90 top
E434  EMIFILTERLONG  [EMIFILTLONG]  30.73,232.41 90 top
E435  EMIFILTERLONG  [EMIFILTLONG]  43.43,232.41 90 top
E441  EMIFILTERLONG  [EMIFILTLONG]  289.18,178.82 180 top
E442  EMIFILTERLONG  [EMIFILTLONG]  289.18,182.63 180 top
E443  EMIFILTERLONG  [EMIFILTLONG]  264.41,182.5 180 top
E444  EMIFILTERLONG  [EMIFILTLONG]  264.41,178.82 180 top
E501  47R  [EMIFILTLONG]  105.66,226.69 180 top
E502  47R  [EMIFILTLONG]  173.48,226.69 180 top
E503  47R  [EMIFILTLONG]  155.19,226.69 0 top
E511  EMIFILTER  [EMIFILTER]  101.85,231.14 90 top
E512  EMIFILTER  [EMIFILTER]  105.03,231.14 90 top
E513  EMIFILTER  [EMIFILTER]  108.2,231.14 90 top
E514  EMIFILTER  [EMIFILTER]  111.38,231.14 90 top
E515  EMIFILTER  [EMIFILTER]  114.55,231.14 90 top
E516  EMIFILTER  [EMIFILTER]  117.73,231.14 90 top
E517  EMIFILTER  [EMIFILTER]  120.9,231.14 90 top
E518  EMIFILTER  [EMIFILTER]  124.08,231.14 90 top
E519  EMIFILTER  [EMIFILTER]  127.25,231.14 90 top
E520  EMIFILTER  [EMIFILTER]  98.04,238.76 270 top
E521  EMIFILTER  [EMIFILTER]  130.43,231.14 90 top
E522  EMIFILTER  [EMIFILTER]  133.6,231.14 90 top
E523  EMIFILTER  [EMIFILTER]  136.78,231.14 90 top
E524  EMIFILTER  [EMIFILTER]  139.95,231.14 90 top
E531  EMIFILTER  [EMIFILTER]  153.92,238.76 270 top
E532  EMIFILTER  [EMIFILTER]  188.21,231.14 90 top
E533  EMIFILTER  [EMIFILTER]  181.86,231.14 90 top
E534  EMIFILTER  [EMIFILTER]  185.04,231.14 90 top
E535  EMIFILTER  [EMIFILTER]  178.69,231.14 90 top
E536  EMIFILTER  [EMIFILTER]  175.51,231.14 90 top
E537  EMIFILTER  [EMIFILTER]  169.16,231.14 90 top
E538  EMIFILTER  [EMIFILTER]  157.1,238.76 270 top
E601  EMIFILTERLONG  [EMIFILTLONG]  245.36,231.14 90 top
E602  EMIFILTERLONG  [EMIFILTLONG]  241.81,231.14 90 top
E611  EMIFILTER  [EMIFILTER]  218.06,231.14 90 top
E612  EMIFILTER  [EMIFILTER]  221.23,231.14 90 top
E613  EMIFILTER  [EMIFILTER]  228.85,231.14 90 top
E614  EMIFILTER  [EMIFILTER]  232.03,231.14 90 top
E615  EMIFILTER  [EMIFILTER]  235.2,231.14 90 top
E616  EMIFILTER  [EMIFILTER]  238.38,231.14 90 top
E617  EMIFILTER  [EMIFILTER]  214.88,238.76 270 top
E618  EMIFILTER  [EMIFILTER]  211.71,238.76 270 top
E619  EMIFILTER  [EMIFILTER]  208.53,238.76 270 top
E620  EMIFILTER  [EMIFILTER]  205.36,238.76 270 top
E621  EMIFILTER  [EMIFILTER]  202.18,238.76 270 top
E622  EMIFILTER  [EMIFILTER]  199.01,238.76 270 top
E623  EMIFILTER  [EMIFILTER]  191.39,238.76 270 top
E624  EMIFILTER  [EMIFILTER]  254.89,238.76 270 top
E625  EMIFILTER  [EMIFILTER]  251.71,238.76 270 top
E626  EMIFILTER  [EMIFILTER]  248.54,238.76 270 top
E631  EMIFILTER  [EMIFILTER]  156.46,205.74 0 top
E632  EMIFILTER  [EMIFILTER]  164.08,202.56 180 top
E666  22pF  [C10B4]  39.62,156.21 180 top
E702  EMIFILTER  [EMIFILTER]  16.76,152.4 0 top
E703  EMIFILTER  [EMIFILTER]  16.76,148.59 0 top
E704  EMIFILTER  [EMIFILTER]  16.76,144.78 0 top
E791  47pF  [R10B4]  39.62,153.67 180 top
E792  47pF  [R10B4]  39.62,151.13 180 top
E793  47pF  [R10B4]  39.62,146.05 180 top
E794  47pF  [R10B4]  39.62,148.59 180 top
FB101  68R  [EMIFILTLONG]  54.86,153.67 180 top
FB102  150  [EMIFILTLONG]  54.86,156.21 180 top
FB802  [R10B4]  277.11,237.49 270 top
HY1  HY1  [SIP22]  40.89,212.09 0 top
JP1  [SJ]  277.75,150.5 0 top
JP2  [SJ_2]  82.8,105.41 270 top
JP3  [JP2Q]  173.61,41.91 90 top
JP4A  JP4A  [A0R-JMP]  203.45,33.66 0 top
JP4B  JP4B  [A0R-JMP]  205.61,28.19 0 top
JP7A  [JP2]  209.17,118.75 180 top
JP7B  [SJ_2]  101.22,217.81 0 top
JP8  [SJ_2]  140.72,227.58 180 top
JP9  [JP1]  215.52,127 90 top
JP10A  [SJ]  307.59,145.41 270 top
JP10B  [SJ]  269.49,238.76 0 top
JP11  [SJ_2]  38.99,236.22 90 top
LF1  AMIGALINEFILTER  [DK31]  82.17,232.03 0 top
OSC  OSC  [AMIGACRYSTAL]  72.64,146.05 90 top
Q301  2N3906  [TO92D]  282.19,144.78 180 top
Q321  MPF102  [TO92-]  267.59,127 180 top
Q331  MPF102  [TO92-]  295.53,127 180 top
Q501  2N3904  [TO92]  160.27,212.09 180 top
Q502  2N3906  [TO92D]  172.97,212.09 180 top
Q503  2N3906  [TO92D]  172.97,204.47 180 top
Q711  TRANSISTOR_2N3904  [TRANSISTOR_TO92-ECB]  277.62,155.57 180 top
R101  27R  [R10B4]  231.39,125.73 90 top
R102  27R  [R10B4]  239.01,125.73 90 top
R103  47R  [R10B4]  109.47,128.27 270 top
R104  47R  [R10B4]  112.01,128.27 270 top
R105  47R  [R10B4]  106.93,128.27 270 top
R106  47R  [R10B4]  101.85,128.27 270 top
R107  47R  [R10B4]  104.39,128.27 270 top
R109  68R  [R10B4]  84.07,198.12 0 top
R111  68R  [R10B4]  183.77,123.83 90 top
R112  68R  [R10B4]  233.93,125.73 90 top
R113  47R  [R10B4]  228.85,125.73 90 top
R114  68R  [R10B4]  193.93,123.83 270 top
R191  1K  [R10B4]  117.09,219.71 180 top
R192  1K  [R10B4]  117.09,215.9 180 top
R201  [R10B4]  37.08,21.59 270 top
R202  [R10B4]  39.62,21.59 270 top
R301  10R  [R10B4]  280.92,111.76 180 top
R302  10R  [R10B4]  280.92,104.14 0 top
R303  1K  [R10B4]  280.92,119.38 0 top
R304  1K  [R10B4]  280.92,116.84 180 top
R305  1K  [R10B4]  204.72,205.74 270 top
R306  10K  [R10B4]  265.68,140.97 0 top
R307  2.7K  [R10B4]  265.68,143.51 0 top
R308  10K  [R10B4]  298.7,140.97 0 top
R309  1R  [R10B4]  96.77,133.35 90 top
R321  360R  [R10B4]  265.68,119.38 180 top
R322  10K  [R10B4]  265.68,135.89 0 top
R323  10K  [R10B4]  265.68,133.35 180 top
R324  1K  [R10B4]  270.76,227.33 270 top
R325  390R  [R10B4]  273.3,227.33 270 top
R326  470K  [R10B4]  265.68,138.43 0 top
R331  360R  [R10B4]  298.7,119.38 0 top
R332  10K  [R10B4]  298.7,130.81 180 top
R333  10K  [R10B4]  298.7,133.35 0 top
R334  1K  [R10B4]  291.08,231.14 90 top
R335  390R  [R10B4]  293.62,231.14 270 top
R336  470K  [R10B4]  298.7,138.43 0 top
R339  10K  [R10B4]  298.7,114.3 180 top
R401  4.7R  [R10B4]  330.45,214.63 270 top
R402  4.7K  [R10B4]  84.07,200.66 180 top
R403  4.7K  [R10B4]  84.07,203.2 180 top
R404  4.7K  [R10B4]  84.07,195.58 180 top
R405  .47R  [R10B4]  84.07,208.91 0 top
R406  4.7K  [0207/10]  21.84,217.17 180 top
R408  4.7R  [R10B4]  327.28,214.63 270 top
R409  150R  [R10B4]  9.14,237.49 270 top
R501  10K  [R10B4]  160.27,193.04 270 top
R502  2.7K  [R10B4]  162.81,193.04 270 top
R503  4.7K  [R10B4]  165.35,193.04 90 top
R504  4.7K  [R10B4]  170.43,193.04 270 top
R505  10K  [R10B4]  167.89,193.04 90 top
R506  10K  [R10B4]  172.97,193.04 270 top
R507  100R  [R10B4]  175.51,193.04 90 top
R711  1M  [R10B4]  259.33,154.31 180 top
R712  47K  [R10B4]  259.33,151.76 180 top
R713  1K  [R10B4]  280.92,161.29 0 top
R911  470R  [R10B4]  247.9,106.68 0 top
R913  470R  [R10B4]  247.9,104.01 180 top
R914  10K  [R10B4]  209.42,58.61 270 top
R915  1K  [R10B4]  236.47,125.73 90 top
R916  1K  [R10B4]  196.47,123.83 270 top
RP101  4.7K  [SIL10]  219.33,158.75 180 top
RP102  4.7K  [SIL10]  50.93,117.47 270 top
RP103  [SIL10]  47.24,160.02 180 top
RP104  470R  [SIL10]  33.27,25.4 90 top
RP105  4.7K  [SIL10]  211.07,132.08 180 top
RP106  4.7K  [SIL10]  15.49,111.76 270 top
RP107  4.7K  [SIL10]  55.63,117.47 270 top
RP108  4.7K  [SIL10]  18.44,69.34 270 top
RP109  4.7K  [SIL10]  143.26,53.85 180 top
RP110  4.7K  [SIL10]  52.96,61.59 270 top
RP111  4.7K  [SIL10]  144.53,51.05 180 top
RP201  [SIL10]  158.37,22.86 270 top
RP202  [SIL10]  162.18,22.86 270 top
RP203  [SIL10]  183.13,33.66 270 top
RP401  [SIL10]  349.5,199.39 0 top
RP402  47  [SIL10]  42.16,224.79 180 top
RP403  47  [SIL10]  42.16,220.98 180 top
RP501  [SIL10]  138.68,217.17 180 top
SV1  [AMIGA56]  218.44,39.5 90 bottom
TC9  6.8-4SPF  [CTRIM3050.504]  204.72,68.58 90 top
U1  [DIL64]  34.29,92.2 90 top
U2  [PLCC84]  110.24,101.6 270 top
U3  PAULA_DIP  [DIP48-6]  136.14,144.78 180 top
U4  DENISE HR  [DIP48-6]  44.7,185.42 180 top
U5  [DIP48-6]  214.88,144.78 180 top
U6  1/2MB_ROM27C800  [DIP42-6]  71.88,79.43 270 top
U7  8520 CIA  [DIP40-6]  125.98,203.2 180 top
U8  8520 CIA  [DIP40-6]  239.01,194.31 180 top
U9  MSM6242B  [DIL18]  182.12,65.53 180 top
U10  74LS244  [DIL20]  161.04,104.14 180 top
U11  74LS373  [DIL20]  155.88,84.58 180 top
U12  74LS244  [DIL20]  193.99,102.36 180 top
U13  74LS373  [DIL20]  190.18,82.42 180 top
U14  LF347/TL084  [DIL14]  282.19,132.08 270 top
U15  74LS157N  [DIL16]  284.73,191.77 180 top
U16  1MX4_DRAML  [DIL20]  133.6,22.86 270 top
U17  1MX4_DRAML  [DIL20]  105.66,22.86 270 top
U18  1MX4_DRAML  [DIL20]  77.72,22.86 270 top
U19  1MX4_DRAML  [DIL20]  49.78,22.86 270 top
U20  1MX4_DRAML  [DIL20]  146.3,22.86 270 top
U21  1MX4_DRAML  [DIL20]  118.36,22.86 270 top
U22  1MX4_DRAML  [DIL20]  90.42,22.86 270 top
U23  1MX4_DRAML  [DIL20]  62.48,22.86 270 top
U32  74F139  [DIL16]  204.6,33.02 270 top
U33  74F258N  [DIL16]  44.7,167.64 180 top
U34  74F373  [DIL20]  171.7,22.86 270 top
U35  74F244  [DIL20]  192.53,33.6 270 top
U36  74LS05N  [DIL14]  283.46,209.55 180 top
U37  74LS32  [DIL14]  283.46,169.42 180 top
U38  MC1488N  [DIL14]  186.94,193.04 180 top
U39  MC1489  [DIL14]  186.94,207.01 180 top
U40  74HCT245  [DIL20]  25.65,201.93 0 top
U41  74HCT245  [DIL20]  56.13,201.93 0 top
U42  NE555  [DIL-08]  287.27,153.67 180 top
U$1  HY1A  [HY1A]  72.64,212.09 0 top
X3  MAB5SH  [MAB5SH]  78.99,245.87 0 top
Y9  32768HZ  [HC49TL-H]  199.01,70.87 0 top

## Tracks (layer width: path | path; a pad name or v marks a point on that pad's centre or on a via)
0VL  (via drill 0.41 pad 0.61)
  Top 0.203: U7.2 147.57,208.91 146.94,208.28 146.94,200.66 149.48,198.12 151.38,198.12 152.02,197.49 v152.02,192.41 | v188.21,183.51 188.21,166.37 192.02,162.56 195.2,162.56 195.83,161.93 v195.83,151.13 195.83,139.7 197.1,138.43 U5.30 | RP101.9 210.44,157.48 211.07,156.84 v211.07,150.5
  Bottom 0.203: v152.02,192.41 152.02,190.5 158.37,183.51 v188.21,183.51 | v195.83,151.13 196.47,150.5 v211.07,150.5
7MHZ  (via drill 0.41 pad 0.61)
  Top 0.203: v38.35,88.9 38.35,142.24 39.62,143.51 v39.62,144.78 | v93.6,151.13 94.23,150.5 94.23,135.89 93.6,135.25 93.6,133.99 v94.23,133.35 | v12.32,144.78 12.32,149.22 11.68,149.86 CN8.7
  Bottom 0.203: v38.35,88.9 38.86,88.39 U1.15 47.75,88.39 48.83,87.31 50.42,87.31 50.74,87 50.74,84.77 49.15,83.19 49.15,81.28 E103.2 | v93.6,151.13 92.96,150.5 68.2,150.5 62.48,144.78 v39.62,144.78 39.62,149.86 38.99,150.5 37.72,150.5 37.08,149.86 34.54,149.86 28.51,143.83 28.51,143.51 13.59,143.51 v12.32,144.78 | v94.23,133.35 94.87,132.72 101.22,132.72 R106.1
7MHZ_A  (via drill 0.41 pad 0.61)
  Top 0.203: U4.35 38.35,176.53 38.35,174.62 37.08,173.35 37.08,168.28 37.72,167.64 40.26,167.64 v40.89,167 | C403.1 99.27,156.88 103.12,153.03 103.12,139.06 v95.5,131.44 | E794.2 32.96,148.59 32,149.54 32,157.16 32.64,157.8 36.45,157.8 37.08,158.43 37.08,165.74 v37.4,166.05
  Bottom 0.203: C403.1 96.77,170.81 95.5,169.54 83.44,169.54 82.17,168.28 42.16,168.28 v40.89,167 39.94,166.05 v37.4,166.05 | v95.5,131.44 102.49,131.44 R107.1
+5  (1 unrouted)
  Bottom 1.27: X3.1 86.61,239.4 LF1.2
+12
  Bottom 1.27: X3.3 71.37,240.66 LF1.4
+12V  (via drill 0.41 pad 0.61)
  Top 0.61: v28.19,144.78 28.19,173.99 12.95,173.99 8.51,178.44 8.51,208.91 11.05,211.46 11.05,215.26 16.13,220.34 23.75,220.34 24.38,220.98 E404.1 E404.2 | v70.1,221.62 70.1,219.71 78.36,219.71 v78.36,217.17 78.36,214.63 78.99,214 U$1.3 | CN14.1 v199.64,222.88 CN12.1 199.64,189.23 | 199.64,189.23 U38.14 | C821.+ 199.64,189.23 | v306.32,224.16 306.32,216.53 307.59,214 v307.59,149.86 | v283.46,111.76 R301.1 | E602.2 E602.1 v241.81,224.16
  Bottom 0.203: R911.2 254.25,106.68 255.52,107.95 258.7,107.95 259.33,107.31 259.33,99.06
  Bottom 0.61: v28.19,144.78 E704.2 | E404.2 24.38,232.41 68.83,232.41 68.83,221.62 v70.1,221.62 74.55,221.62 74.55,222.88 | 74.55,222.88 LF1.5 | C802.1 v78.36,217.17 | 74.55,222.88 95.5,222.88 98.04,224.79 170.43,224.79 172.34,226.82 E502.2 E502.1 181.1,222.88 v199.64,222.88 209.17,222.88 210.44,224.16 v241.81,224.16 258.7,224.16 258.7,227.33 270.76,227.33 270.76,224.16 v306.32,224.16 | E602.1 241.55,227.33 | v307.59,149.86 313.31,149.86 313.31,99.06 283.46,99.06 283.46,105.41 | 283.46,105.41 v283.46,111.76 | SV1.55 216.15,83.95 216.15,99.06 259.33,99.06 280.92,99.06 280.92,105.41 283.46,105.41
+AV  (via drill 0.41 pad 0.61)
  Top 0.61: v280.29,141.6 283.46,141.6 Q301.E 283.46,146.05 272.67,146.05 272.67,143.51 R307.2 | C303.+ R301.2
  Bottom 0.61: U14.4 280.29,132.08 | 280.29,132.08 v280.29,141.6 | C301.1 R301.2 280.29,111.76 280.29,132.08
+VID
  Top 0.61: R406.2 HY1.2 16.76,208.28 14.86,208.28 14.22,207.65 U40.20 14.22,204.79 15.18,203.84 40.89,203.84 C41.1
  Bottom 0.61: C402.+ 10.41,217.17 R406.2 | C40.1 14.22,207.01 U40.20 U40.1 | U41.1 U41.20 40.89,205.74 C41.1
+VXX  (via drill 0.41 pad 0.61)
  Top 0.61: C4.1 11.68,191.77 12.32,192.41 v12.32,194.94 12.32,215.26 16.13,219.07 25.02,219.07 R406.1 26.92,226.06 27.56,226.69 E405.1 E405.2 | v69.47,215.9 v68.2,217.17
  Bottom 0.61: 69.47,198.75 69.47,195.58 68.83,194.94 26.92,194.94 | 26.92,194.94 v12.32,194.94 | U4.19 26.92,194.94 | 69.47,198.75 70.1,199.39 E406.2 | 69.47,198.75 v69.47,215.9 | v68.2,217.17 R406.1
-12
  Bottom 1.27: X3.5 73.91,247.65 78.99,242.57 78.99,238.12 LF1.3
-12V  (via drill 0.41 pad 0.61)
  Top 0.61: v26.92,148.59 26.92,172.09 26.29,172.72 12.32,172.72 7.24,177.8 7.24,209.55 9.78,212.09 9.78,215.26 16.13,221.62 20.57,221.62 21.21,222.25 E403.1 E403.2 | LF1.6 79.63,224.79 81.53,224.79 v81.53,224.16 81.53,219.71 C803.2 | v197.1,225.43 197.1,196.85 U38.1 | v200.91,196.85 v200.91,191.77 | v308.86,193.04 v308.86,151.13 | v282.19,104.14 R302.2
  Bottom 0.61: v26.92,148.59 E703.2 | E403.2 21.21,231.14 63.12,231.14 63.12,218.44 81.53,218.44 81.53,219.71 C803.2 | v81.53,224.16 93.6,224.16 98.68,229.24 109.47,229.24 111.51,226.44 E503.1 E503.2 157.73,227.97 177.42,227.97 179.96,225.43 v197.1,225.43 | U38.1 v200.91,196.85 | v200.91,191.77 211.07,191.77 211.07,191.13 268.22,191.13 | C822.- 268.22,191.13 | 268.22,191.13 272.67,191.13 272.67,193.04 v308.86,193.04 | v308.86,151.13 314.58,151.13 314.58,97.79 282.19,97.79 | 282.19,97.79 v282.19,104.14 | SV1.56 219.96,83.95 219.96,97.79 282.19,97.79
-AV
  Bottom 0.61: R308.1 282.19,140.97 282.19,132.08 | U14.11 282.19,132.08 | 282.19,132.08 282.19,106.68 C302.2 275.84,105.41 | 275.84,105.41 R302.1 | C304.- 275.84,105.41
_0VR  (via drill 0.41 pad 0.61)
  Top 0.203: RP104.9 35.81,34.29 36.45,34.92 36.45,142.88 v35.81,143.51 | v12.32,137.16 CN8.17
  Bottom 0.203: v12.32,137.16 14.86,137.16 17.4,139.7 30.1,139.7 33.27,142.88 34.54,142.88 35.18,143.51 v35.81,143.51 37.08,142.24 63.44,142.24 65.34,140.34 69.47,140.34 70.1,140.97 87.25,140.97 87.88,141.6 94.23,141.6 94.87,142.24 107.57,142.24 110.11,140.65 111.7,139.7 192.98,139.7 194.56,138.43 U5.29
_AS  (via drill 0.41 pad 0.61)
  Top 0.203: U1.6 43.43,64.14 43.43,46.35 v44.07,45.72 | v123.44,52.07 123.44,53.34 124.08,53.98 124.08,71.12 121.54,73.66 118.36,73.66 113.92,78.11 113.92,89.53 113.28,90.17 112.65,90.17 109.47,93.34 109.47,113.03 108.84,113.67 108.84,115.7 U2.24 | RP101.8 212.98,154.31 212.34,153.67 U5.13 v212.34,149.86 | v202.18,149.86 200.91,149.86 200.28,149.22 200.28,142.88 203.45,139.7 204.72,139.7 205.99,138.43 205.99,128.91 205.36,128.27 v205.36,122.56
  Bottom 0.203: v44.07,45.72 44.7,46.35 80.9,46.35 89.15,55.24 106.3,55.24 110.11,51.44 123.44,51.44 v123.44,52.07 | U1.6 34.42,65.53 33.27,66.67 11.05,66.67 10.41,66.04 CN8.74 | v212.34,149.86 v202.18,149.86 | v205.36,122.56 113.92,122.56 113.28,121.92 111.38,121.92 107.57,118.11 107.57,116.97 U2.24
_BCASL(0)
  Top 0.203: RP203.7 184.4,29.84 185.67,28.57 192.66,28.57 195.2,31.11 197.74,31.11 198.37,31.75 198.37,33.02 199.64,34.29 U32.4 200.91,34.29 202.18,35.56 203.25,35.56 JP4A.1
_BCASL(1)
  Top 0.203: JP4A.3 203.25,31.75 U32.5 204.41,31.75 205.04,32.38 205.04,34.61 205.99,35.56 210.12,35.56 211.65,36.83 211.65,50.99 213.68,53.4 213.68,57.53 214.57,58.42 217.04,58.42 SV1.35
_BCASU(0)  (via drill 0.41 pad 0.61)
  Top 0.203: U32.12 208.41,31.62 206.63,29.84 205.66,29.84 JP4B.1 205.56,29.84 204.72,29.84 202.82,27.94 199.01,27.94 197.1,26.04 v193.29,26.04 | v193.29,31.11 186.94,31.11 186.31,31.75 186.31,34.29 185.67,34.92 RP203.5
  Bottom 0.203: v193.29,31.11 v193.29,26.04
_BCASU(1)
  Top 0.203: JP4B.3 205.82,26.49 207.26,27.94 207.26,28.57 207.9,29.21 U32.11 208.85,29.21 212.09,32.07 212.09,50.93 214.12,53.21 214.12,57.02 214.25,57.15 218.31,57.15 SV1.36
_BEER
  Top 0.203: RP104.5 34.54,24.13 35.18,24.77 35.18,26.04 35.81,26.67 35.81,27.94 38.99,31.11 38.99,78.11 40.26,79.38 40.26,100.71 U1.22
  Bottom 0.203: U1.22 41.02,106.17 39.62,104.78 18.67,104.78 18.03,104.14 14.22,104.14 12.32,102.23 11.05,102.23 10.41,101.6 CN8.46
_BG
  Bottom 0.203: U1.11 35.05,78.23 33.91,79.38 11.05,79.38 10.41,78.74 CN8.64
_BGACK  (via drill 0.41 pad 0.61)
  Top 0.203: RP104.6 34.54,26.67 35.18,27.3 35.18,28.57 38.35,31.75 38.35,80.01 v38.99,80.64 39.62,81.28 39.62,84.45 37.72,85.72 37.72,142.88 v38.35,143.51
  Bottom 0.203: U1.12 45.59,80.64 v38.99,80.64 35.18,80.64 33.91,81.92 11.05,81.92 10.41,81.28 CN8.62 | v38.35,143.51 61.85,143.51 68.2,149.86 99.95,149.86 101.85,151.76 102.49,151.76 104.39,149.86 192.66,149.86 193.29,150.5 193.29,153.03 193.93,153.67 208.53,153.67 U5.14
_BR  (via drill 0.41 pad 0.61)
  Top 0.203: RP104.7 34.54,29.21 37.72,32.38 37.72,82.55 v38.35,83.19
  Bottom 0.203: U1.13 45.59,83.19 v38.35,83.19 35.18,83.19 33.91,84.45 11.05,84.45 10.41,83.82 CN8.60
_BRAS(0)  (via drill 0.41 pad 0.61)
  Top 0.203: SV1.38 219.71,61.02 218.69,60.01 215.2,60.01 213.23,58.17 213.23,53.72 211.2,51.44 211.2,38.42 210.76,38.1 v206.63,38.1 | v206.63,43.81 186.63,43.81 185.36,45.09 RP203.1 176.78,45.09 JP3.3
  Bottom 0.203: v206.63,38.1 v206.63,43.81
_BRAS(1)
  Top 0.203: SV1.37 215.33,61.09 212.79,58.67 212.79,53.91 210.63,51.75 210.63,41.59 209.8,40.64 204.72,40.64 202.5,42.86 199.14,42.86 198.5,42.23 198.5,39.62 197.74,38.73 195.2,38.73 193.29,36.83 191.07,36.83 190.44,36.2 187.58,36.2 186.31,37.47 186.31,39.37 185.67,40.01 RP203.3 183.01,40.13 175.39,40.13 JP3.1
_BWE
  Top 0.203: SV1.39 215.33,63.63 212.34,60.64 212.34,53.98 210.06,51.94 210.06,42.86 205.04,42.86 204.28,43.37 198.88,43.37 198.06,42.55 198.06,41.59 197.74,41.27 193.29,41.27 192.02,40.01 188.77,40.01 U35.3
  Bottom 0.203: U35.3 189.53,39.95 190.44,39.05 190.44,26.35 190.12,26.04 186.94,26.04 185.67,24.77 RP203.9
_CASL  (via drill 0.41 pad 0.61)
  Top 0.203: U2.53 94.23,88.9 93.6,88.27 93.6,53.98 94.23,53.34 94.23,52.7 95.5,51.44 v98.04,51.44 | U32.3 199.64,36.83 198.37,35.56 198.37,34.29 197.74,33.66 194.56,33.66 193.29,32.38 188.77,32.38 U35.6
  Bottom 0.203: U35.6 187,32.33 186.31,33.02 186.31,46.99 184.4,48.9 169.16,48.9 167.26,46.35 108.84,46.35 107.57,48.26 105.03,48.26 102.49,50.8 100.58,50.8 99.95,51.44 v98.04,51.44
_CASU  (via drill 0.41 pad 0.61)
  Top 0.203: U2.54 97.41,86.36 97.41,85.09 94.87,82.55 94.87,55.88 99.31,51.44 v99.31,50.16 | U35.8 188.77,27.3 193.29,27.3 194.56,28.57 198.37,28.57 198.37,29.21 199.64,30.48 204.09,30.48 204.72,31.11 205.36,31.11 205.99,31.75 205.99,32.07 206.63,32.7 206.63,33.66 207.26,34.29 U32.13
  Bottom 0.203: U35.8 187.63,27.25 185.67,29.21 185.67,46.99 184.4,48.26 169.16,48.26 167.26,45.72 108.84,45.72 107.57,47.62 105.03,47.62 102.49,50.16 v99.31,50.16
_CCK  (via drill 0.41 pad 0.61)
  Top 0.203: v38.99,158.12 35.81,154.94 33.27,154.94 32.64,154.31 32.64,151.45 32.96,151.13 E792.2 37.08,151.13 37.72,150.5 v37.72,147.96
  Bottom 0.203: RP103.6 45.97,158.75 45.34,158.12 v38.99,158.12 | v37.72,147.96 37.72,145.1 37.4,144.91 32.64,144.91 29.15,141.29 16.45,141.29 13.91,138.75 12,138.75 10.73,139.7 CN8.16
_CCK_A  (via drill 0.41 pad 0.61)
  Top 0.203: v211.84,128.27 211.84,128.91 211.07,130.18 211.07,139.7 206.63,144.15 206.63,149.86 205.99,150.5 205.99,158.12 v202.18,161.93 | v63.75,163.51 63.75,160.02 61.21,157.48 61.21,153.03 60.9,152.72 57.09,152.72 54.55,150.18 49.47,150.18 E104.3 | SV1.40 218.57,64.77 218.57,67.06 218.31,67.31 214.25,67.31 214.25,94.93 212.66,96.52 212.66,98.74 213.11,99.57 213.11,103.89 215.65,106.17 215.52,116.84 219.33,120.65 E102.2 226.31,124.08 v224.41,125.98
  Bottom 0.203: v202.18,161.93 98.04,161.93 97.41,162.56 82.17,162.56 80.9,163.51 v63.75,163.51 | v211.84,128.27 212.09,128.27 212.98,129.16 217.68,129.16 220.47,126.36 224.03,126.36 v224.41,125.98
_CCKQ  (via drill 0.41 pad 0.61)
  Top 0.203: RP103.8 40.89,158.75 35.81,153.67 E791.2 34.54,152.72 34.86,152.4 37.72,152.4 38.35,151.76 v38.35,149.22
  Bottom 0.203: v38.35,149.22 36.45,149.22 35.81,148.59 35.81,147.96 35.18,147.32 33.27,147.32 29.15,142.88 16.13,142.88 15.49,142.24 CN8.14
_CCKQ_A  (via drill 0.41 pad 0.61)
  Top 0.203: v77.09,201.93 77.09,197.49 77.72,196.85 77.72,194.94 77.09,194.31 77.09,173.99 75.18,172.09 68.83,172.09 66.29,169.54 66.29,160.66 65.66,160.02 64.39,160.02 61.85,157.48 61.85,152.4 61.53,152.08 57.4,152.08 54.86,149.54 49.47,149.54 E105.3 | U15.1 293.62,197.1 292.99,197.74 v287.53,197.74
  Bottom 0.203: U15.1 293.62,196.53 294.89,197.8 301.88,197.8 302.51,197.17 E109.2 | v77.09,201.93 85.34,201.93 87.88,204.47 89.79,204.47 95.5,198.75 125.35,198.75 130.43,202.56 134.24,202.56 135.51,203.84 141.86,203.84 142.49,203.2 151.38,203.2 157.1,195.58 157.73,194.94 195.83,194.94 198.37,192.41 211.39,192.41 212.03,191.77 271.08,191.77 272.35,193.8 287.02,193.8 287.27,194.06 287.27,197.49 v287.53,197.74
_CDAC  (via drill 0.41 pad 0.61)
  Top 0.203: v40.89,173.99 40.89,178.44 40.26,179.07 37.72,179.07 37.08,178.44 U4.34 37.08,175.26 36.45,174.62 34.54,174.62 33.91,173.99 33.91,169.54 36.45,167 38.35,167 39.62,165.74 39.62,162.56 40.26,161.93 41.53,161.93 42.16,161.29 v42.16,147.96 | v186.31,151.13 186.31,138.43 186.94,137.79 U5.26 186.94,133.35 186.31,132.72 E106.2 | v95.5,135.89 95.5,152.4 v94.87,153.03
  Bottom 0.203: v40.89,173.99 47.88,173.99 48.51,173.35 U33.3 U33.2 | v42.16,147.96 42.8,147.32 61.21,147.32 65.66,151.76 80.9,151.76 81.53,152.4 88.52,152.4 89.15,153.03 v94.87,153.03 101.85,153.03 104.39,150.5 185.67,150.5 v186.31,151.13 | R105.1 106.3,133.99 105.66,133.99 105.03,134.62 98.04,134.62 96.77,135.89 v95.5,135.89
_CHNG
  Top 0.203: E616.1 238.38,230.5 240.03,228.98 240.03,215.9 246.08,215.9 CN11.2
  Bottom 0.203: U7.4 142.49,212.72 152.65,212.72 154.56,214 167.89,214 167.89,210.19 170.43,207.65 179.32,207.65 180.59,208.91 180.59,212.72 181.23,213.36 197.74,213.36 198.37,212.72 198.37,208.53 200.91,206.38 232.92,206.38 232.92,212.34 233.3,212.72 247.27,212.72 247.27,214.71 CN11.2
_CLKRD
  Top 0.203: U5.22 189.48,150.5 190.12,149.86 190.12,149.22 189.48,148.59 189.48,139.7 188.21,138.43 188.21,133.35 187.58,132.72 187.58,127.64 189.48,125.73 193.29,125.73 195.2,123.83 195.2,117.47 194.56,116.84 192.66,116.84 188.85,113.03 178.69,113.03 177.42,109.86 177.42,94.61 175.51,91.44 175.51,76.2 173.61,74.3 173.61,71.75 174.24,71.12 174.24,69.6 U9.8
  Bottom 0.203: U9.8 175.01,69.34 176.78,71.12 177.42,71.12 179.96,73.66 192.02,73.66 195.2,76.2 217.04,76.2 SV1.49
_CLKWR  (via drill 0.41 pad 0.61)
  Top 0.203: U5.23 186.94,151.76 188.21,150.5 v188.21,141.6 | v190.75,141.6 190.75,133.35 190.12,132.72 190.12,128.27 192.02,126.36 196.47,126.36 197.74,125.09 197.74,116.84 197.1,116.2 192.66,116.2 188.85,112.39 179.32,112.39 178.05,109.86 178.05,93.98 176.15,91.44 176.15,76.2 174.24,74.3 174.24,71.75 174.88,71.12 180.59,71.12 | U9.10 171.7,61.47 171.7,59.69 172.02,59.37 183.13,59.37 183.45,59.69 183.45,62.55 180.91,65.09 180.91,70.8 180.59,71.12 | 180.59,71.12 182.5,73.03 188.85,73.03 v190.12,74.3
  Bottom 0.203: v188.21,141.6 v190.75,141.6 | v190.12,74.3 191.39,74.3 193.93,76.83 202.82,76.83 203.45,77.47 203.45,78.11 204.09,78.74 205.36,78.74 205.99,78.11 205.99,77.47 218.57,77.47 SV1.50
_CSYNC  (via drill 0.41 pad 0.61)
  Top 0.203: v87.88,102.87 87.88,103.5 90.42,106.05 90.42,132.08 89.79,132.72 89.79,150.5 92.33,153.03 92.33,161.29 96.14,165.1 96.14,191.77 98.68,194.31 98.68,195.58 v98.04,196.22 | v72.64,194.94 65.66,194.94 65.02,195.58 U41.9 | U41.8 62.48,195.58 61.85,194.94 49.15,194.94 48.51,194.31 48.51,184.78 44.7,180.97 37.08,180.97 35.81,179.71 35.81,176.53 35.18,175.9 33.27,175.9 32,177.16 U4.32
  Bottom 0.203: U2.80 122.17,93.98 120.9,92.71 100.58,92.71 98.04,95.25 90.42,95.25 88.52,97.16 88.52,102.23 v87.88,102.87 | v98.04,196.22 97.41,196.22 96.77,195.58 95.5,195.58 91.69,199.39 87.88,199.39 85.98,197.49 81.53,197.49 80.9,196.85 74.55,196.85 v72.64,194.94 | U41.9 U41.8
_DKRD  (via drill 0.41 pad 0.61)
  Top 0.203: E612.1 221.23,224.16 226.06,219.07 226.06,213.49 226.31,213.23 226.31,207.9 v225.42,207.01 | v212.98,163.83 214.88,163.83 214.88,182.88 216.15,184.15 216.15,204.47 214.25,206.38 v214.25,207.65 v214.25,212.09 | v125.35,163.83 126.62,159.38 129.79,155.57 129.79,149.86 138.05,141.6 138.05,139.06 U3.37
  Bottom 0.203: v225.42,207.01 214.88,207.01 v214.25,207.65 | R305.1 204.72,211.46 205.36,212.09 v214.25,212.09 218.69,212.09 219.33,212.72 219.33,214.65 CN11.30 | v212.98,163.83 v125.35,163.83
_DKWD  (via drill 0.41 pad 0.61)
  Top 0.203: U5.9 222.5,154.31 221.87,154.94 v221.87,163.19 | v129.16,162.56 129.16,161.93 129.79,161.29 129.79,158.12 132.33,155.57 132.33,147.96 139.32,140.97 139.32,137.79 U3.38
  Bottom 0.203: v221.87,163.19 129.79,163.19 v129.16,162.56
_DKWDB  (via drill 0.41 pad 0.61)
  Top 0.203: E621.2 202.18,231.78 204.09,229.87 205.36,229.87 205.99,229.24 205.99,205.1 203.45,202.56 203.45,198.12 v206.63,194.94 | v233.3,194.94 232.03,196.22 227.58,196.22 226.31,197.49 226.31,207.01 226.95,207.65 226.95,214.77 CN11.22 | v255.52,215.9 255.52,205.1 256.79,203.84 v256.79,194.94
  Bottom 0.203: v206.63,194.94 v233.3,194.94 v256.79,194.94 | U36.6 278.38,215.26 277.75,215.9 v255.52,215.9
_DKWEB  (via drill 0.41 pad 0.61)
  Top 0.203: E620.2 205.36,231.78 207.26,229.87 207.9,229.87 209.17,228.6 209.17,210.19 210.44,208.91 v211.71,208.91 | CN11.24 225.04,214.87 225.04,212.72 225.68,212.09 v225.68,208.91 223.77,207.01 v223.77,193.68
  Bottom 0.203: v211.71,208.91 v225.68,208.91 | U36.8 275.84,204.47 272.67,201.29 272.67,198.12 270.13,195.58 261.87,195.58 259.97,193.68 v223.77,193.68
_DTACK  (via drill 0.41 pad 0.61)
  Top 0.203: RP104.2 34.54,16.51 36.45,18.41 36.45,20.32 37.08,20.95 37.08,21.59 37.72,22.23 39.62,22.23 41.53,24.13 41.53,29.84 42.16,30.48 42.16,41.27 42.8,41.91 v42.8,43.18 42.8,44.45 42.16,45.09 42.16,73.03 U1.10 | v127.89,52.7 127.89,74.3 v127.25,78.42 | R101.1 231.39,114.3 230.76,113.67 226.95,113.67 225.68,112.39 | 214.25,102.23 v214.25,96.52
  Top 0.254: 214.25,102.23 214.25,103.38 216.66,105.79 216.66,108.84 218.69,110.87 225.3,110.87 225.55,111.12 225.55,112.27 225.68,112.39
  Bottom 0.203: v42.8,43.18 49.15,43.18 50.42,44.45 80.9,44.45 87.88,51.44 94.87,51.44 97.41,53.98 106.3,53.98 110.11,50.16 125.35,50.16 v127.89,52.7 | U1.10 35.05,75.69 33.91,76.83 11.05,76.83 10.41,76.2 CN8.66 | v127.25,78.42 133.6,88.9 143.13,88.9 144.91,91.5 170.24,91.5 170.69,90.81 173.35,90.81 173.61,91.31 210.88,91.31 211.2,91.38 v214.25,96.52
_EVEN_CIA  (via drill 0.41 pad 0.61)
  Top 0.203: v277.11,191.13 277.11,174.5 U37.6
  Bottom 0.203: U8.23 219.96,187.32 220.6,187.96 272.03,187.96 275.21,191.13 v277.11,191.13
_EXTICK  (via drill 0.41 pad 0.61)
  Top 0.203: v102.49,215.9 102.49,217.55 JP7B.3 102.74,217.55 | v190.75,207.65 190.75,183.51 189.48,182.25 189.48,166.37 192.66,163.19 195.83,163.19 196.47,162.56 196.47,154.94 198.37,153.03 198.37,150.5 199.01,150.5 199.01,142.88 202.18,139.06 U5.32 202.18,134.62 200.91,133.35 200.91,130.81 204.09,127.64 204.09,121.28 203.45,120.65 203.45,116.84 204.09,116.2 208.53,116.2 209.17,116.84 JP7A.2
  Bottom 0.203: RP501.9 129.79,218.44 129.16,219.07 126.62,219.07 125.35,217.81 122.17,217.81 119,214.63 111.38,214.63 110.11,215.9 106.3,215.9 105.66,215.26 | 105.66,215.26 103.12,215.26 v102.49,215.9 | 105.66,215.26 105.66,209.55 106.3,208.91 143.13,208.91 143.76,209.55 143.76,211.46 144.4,212.09 145.67,212.09 146.3,211.46 146.3,209.55 147.57,208.28 163.45,208.28 164.08,208.91 168.53,208.91 170.43,207.01 179.32,207.01 180.59,208.28 190.12,208.28 v190.75,207.65
_FIRE0  (via drill 0.41 pad 0.61)
  Top 0.203: U7.8 132.33,214 133.6,215.26 133.6,218.44 134.24,219.07 v135.51,219.71 | v138.68,219.71 138.68,220.34 139.95,220.34 141.22,221.62 141.22,223.52 142.49,224.79 142.49,227.33 | 142.49,227.33 JP8.1 | 142.49,227.33 142.49,229.24 v141.86,229.87 | E415.2 E415.1
  Bottom 0.203: v135.51,219.71 v138.68,219.71 | E415.1 358.14,208.28 334.9,208.28 331.09,212.09 328.55,212.09 326.01,214.63 326.01,218.44 323.47,220.98 313.94,220.98 309.5,225.43 301.88,225.43 298.7,228.6 247.27,228.6 246,229.87 179.32,229.87 178.05,231.14 155.83,231.14 155.19,230.5 142.49,230.5 v141.86,229.87
_FIRE1  (via drill 0.41 pad 0.61)
  Top 0.203: U7.9 129.79,214 131.06,215.26 131.06,219.07 131.7,219.71 134.24,219.71 139.32,224.79 139.32,227.46 JP8.3 139.19,229.11 v139.32,229.24 | E425.2 E425.1
  Bottom 0.203: E425.2 320.29,215.9 315.21,215.9 314.58,216.53 314.58,219.71 309.5,224.79 284.73,224.79 283.46,226.06 275.21,226.06 273.3,227.97 247.27,227.97 245.36,229.24 179.32,229.24 178.05,230.5 155.83,230.5 155.19,229.87 142.88,229.87 142.24,229.24 v139.32,229.24
_HLT  (via drill 0.41 pad 0.61)
  Top 0.203: v12.32,88.9 CN8.55 | v49.78,92.71 49.78,93.34 60.58,104.14 60.58,136.53 64.39,140.34 67.56,140.34 68.83,141.6 v68.83,143.51 | U5.42 225.68,139.06 v225.68,147.32 226.31,149.22 226.31,154.94 225.68,155.57 RP101.3
  Bottom 0.203: v12.32,88.9 13.59,88.9 16.76,92.08 40.26,92.08 41.66,93.47 U1.17 49.02,93.47 v49.78,92.71 | v68.83,143.51 68.83,144.15 71.37,146.69 82.17,146.69 82.8,147.32 92.96,147.32 93.6,147.96 200.91,147.96 202.18,146.69 205.99,146.69 207.9,147.32 v225.68,147.32
_HSYNC  (via drill 0.41 pad 0.61)
  Top 0.203: U2.81 125.35,96.52 124.08,95.25 122.17,95.25 v120.9,93.98 | v89.15,103.5 91.06,105.41 91.06,132.08 90.42,132.72 90.42,150.5 92.96,153.03 92.96,160.66 v96.77,164.47 96.77,191.77 99.31,194.31 v99.31,196.85 | R402.2 81.53,200.66 81.53,214 80.9,214.63 80.9,224.16 v59.94,224.16 | U8.19 217.42,200.66 216.79,200.03 216.79,189.23 218.69,187.32 218.69,185.42 216.15,182.88 v216.15,167.64
  Bottom 0.203: v120.9,93.98 120.27,93.34 100.58,93.34 99.31,94.61 99.31,97.16 98.68,97.79 89.79,97.79 89.15,98.42 v89.15,103.5 | v99.31,196.85 94.87,196.85 89.79,201.93 87.88,201.93 86.61,200.66 R402.2 | v59.94,224.16 59.94,220.34 58.67,219.07 44.7,219.07 43.43,220.34 RP403.5 | v216.15,167.64 122.81,167.64 120.9,168.28 110.74,168.28 106.93,164.47 v96.77,164.47
_INDEX  (via drill 0.41 pad 0.61)